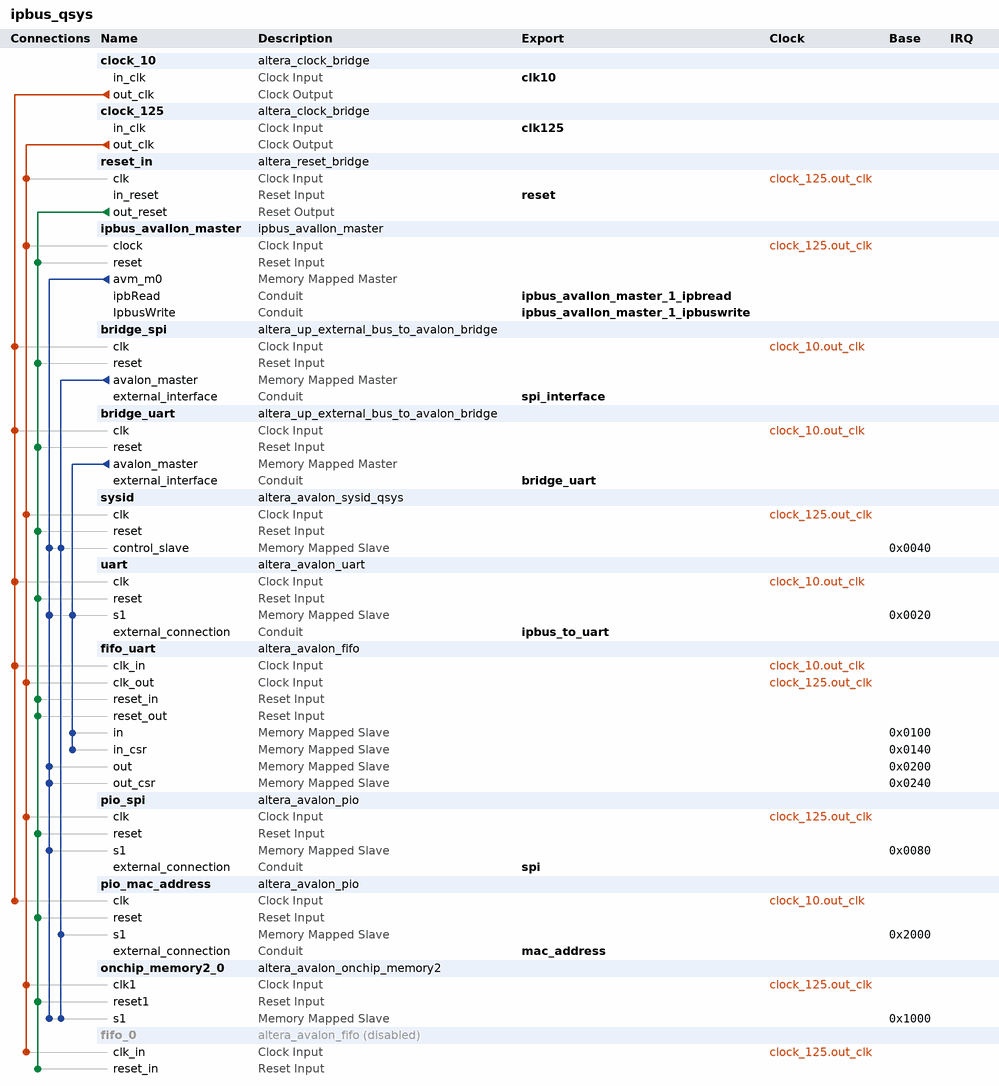
[diagram p0: system contents]
# Platform Designer (Qsys) system ipbus_qsys, Arria 10 10AX027H4F34I3SG
# Parameters at their usual value, and those the tool derives, are not listed.
package require -exact qsys 1.0
create_system ipbus_qsys
set_project_property DEVICE_FAMILY {Arria 10}
set_project_property DEVICE 10AX027H4F34I3SG

add_component clock_10 ip/ipbus_qsys_clock_bridge_10M.ip altera_clock_bridge clock_10 19.1

add_component clock_125 ip/ipbus_qsys_clock_in.ip altera_clock_bridge clock_125 19.1

add_component reset_in ip/ipbus_qsys_reset_in.ip altera_reset_bridge reset_in 19.1

add_component ipbus_avallon_master ip/ipbus_qsys_ipbus_avallon_master_1.ip ipbus_avallon_master ipbus_avallon_master 1.0

add_component bridge_spi ip/ipbus_qsys_bridge_1.ip altera_up_external_bus_to_avalon_bridge bridge_spi 18.0

add_component bridge_uart ip/ipbus_qsys_bridge_uart.ip altera_up_external_bus_to_avalon_bridge bridge_uart 18.0

add_component sysid ip/ipbus_qsys_sysid_qsys_1.ip altera_avalon_sysid_qsys sysid 19.1

add_component uart ip/ipbus_qsys_uart.ip altera_avalon_uart uart 19.1

add_component fifo_uart ip/ipbus_qsys_fifo_uart.ip altera_avalon_fifo fifo_uart 19.1

add_component pio_spi ip/ipbus_qsys_pio_0.ip altera_avalon_pio pio_spi 19.1

add_component pio_mac_address ip/ipbus_qsys_pio_mac.ip altera_avalon_pio pio_mac_address 19.1

add_component onchip_memory2_0 ip/ipbus_qsys_onchip_memory2_0.ip altera_avalon_onchip_memory2 onchip_memory2_0 19.1

add_component fifo_0 ip/ipbus_qsys_fifo_0.ip altera_avalon_fifo fifo_0 19.1
set_instance_property fifo_0 ENABLED false

# connections
add_connection clock_10.out_clk bridge_spi.clk clock
add_connection clock_10.out_clk bridge_uart.clk clock
add_connection clock_10.out_clk fifo_uart.clk_in clock
add_connection clock_10.out_clk pio_mac_address.clk clock
add_connection clock_10.out_clk uart.clk clock
add_connection clock_125.out_clk fifo_0.clk_in clock
add_connection clock_125.out_clk fifo_uart.clk_out clock
add_connection clock_125.out_clk ipbus_avallon_master.clock clock
add_connection clock_125.out_clk onchip_memory2_0.clk1 clock
add_connection clock_125.out_clk pio_spi.clk clock
add_connection clock_125.out_clk reset_in.clk clock
add_connection clock_125.out_clk sysid.clk clock
add_connection reset_in.out_reset bridge_spi.reset reset
add_connection reset_in.out_reset bridge_uart.reset reset
add_connection reset_in.out_reset fifo_0.reset_in reset
add_connection reset_in.out_reset fifo_uart.reset_in reset
add_connection reset_in.out_reset fifo_uart.reset_out reset
add_connection reset_in.out_reset ipbus_avallon_master.reset reset
add_connection reset_in.out_reset onchip_memory2_0.reset1 reset
add_connection reset_in.out_reset pio_mac_address.reset reset
add_connection reset_in.out_reset pio_spi.reset reset
add_connection reset_in.out_reset sysid.reset reset
add_connection reset_in.out_reset uart.reset reset
add_connection bridge_spi.avalon_master onchip_memory2_0.s1 avalon
set_connection_parameter_value bridge_spi.avalon_master/onchip_memory2_0.s1 baseAddress 0x1000
add_connection bridge_spi.avalon_master pio_mac_address.s1 avalon
set_connection_parameter_value bridge_spi.avalon_master/pio_mac_address.s1 baseAddress 0x2000
add_connection bridge_spi.avalon_master sysid.control_slave avalon
set_connection_parameter_value bridge_spi.avalon_master/sysid.control_slave baseAddress 0x0040
add_connection bridge_uart.avalon_master fifo_uart.in avalon
set_connection_parameter_value bridge_uart.avalon_master/fifo_uart.in baseAddress 0x0100
add_connection bridge_uart.avalon_master fifo_uart.in_csr avalon
set_connection_parameter_value bridge_uart.avalon_master/fifo_uart.in_csr baseAddress 0x0140
add_connection bridge_uart.avalon_master uart.s1 avalon
set_connection_parameter_value bridge_uart.avalon_master/uart.s1 baseAddress 0x0020
add_connection ipbus_avallon_master.avm_m0 fifo_uart.out avalon
set_connection_parameter_value ipbus_avallon_master.avm_m0/fifo_uart.out baseAddress 0x0200
add_connection ipbus_avallon_master.avm_m0 fifo_uart.out_csr avalon
set_connection_parameter_value ipbus_avallon_master.avm_m0/fifo_uart.out_csr baseAddress 0x0240
add_connection ipbus_avallon_master.avm_m0 onchip_memory2_0.s1 avalon
set_connection_parameter_value ipbus_avallon_master.avm_m0/onchip_memory2_0.s1 baseAddress 0x1000
add_connection ipbus_avallon_master.avm_m0 pio_spi.s1 avalon
set_connection_parameter_value ipbus_avallon_master.avm_m0/pio_spi.s1 baseAddress 0x0080
add_connection ipbus_avallon_master.avm_m0 sysid.control_slave avalon
set_connection_parameter_value ipbus_avallon_master.avm_m0/sysid.control_slave baseAddress 0x0040
add_connection ipbus_avallon_master.avm_m0 uart.s1 avalon
set_connection_parameter_value ipbus_avallon_master.avm_m0/uart.s1 baseAddress 0x0020

# exported interfaces
add_interface bridge_uart conduit end
set_interface_property bridge_uart EXPORT_OF bridge_uart.external_interface
add_interface clk10 clock sink
set_interface_property clk10 EXPORT_OF clock_10.in_clk
add_interface clk125 clock sink
set_interface_property clk125 EXPORT_OF clock_125.in_clk
add_interface ipbus_avallon_master_1_ipbread conduit end
set_interface_property ipbus_avallon_master_1_ipbread EXPORT_OF ipbus_avallon_master.ipbRead
add_interface ipbus_avallon_master_1_ipbuswrite conduit end
set_interface_property ipbus_avallon_master_1_ipbuswrite EXPORT_OF ipbus_avallon_master.IpbusWrite
add_interface ipbus_to_uart conduit end
set_interface_property ipbus_to_uart EXPORT_OF uart.external_connection
add_interface mac_address conduit end
set_interface_property mac_address EXPORT_OF pio_mac_address.external_connection
add_interface reset reset sink
set_interface_property reset EXPORT_OF reset_in.in_reset
add_interface spi conduit end
set_interface_property spi EXPORT_OF pio_spi.external_connection
add_interface spi_interface conduit end
set_interface_property spi_interface EXPORT_OF bridge_spi.external_interface

save_system ipbus_qsys.qsys
